# EAGLE design powerPanel (EAGLE 4.16)
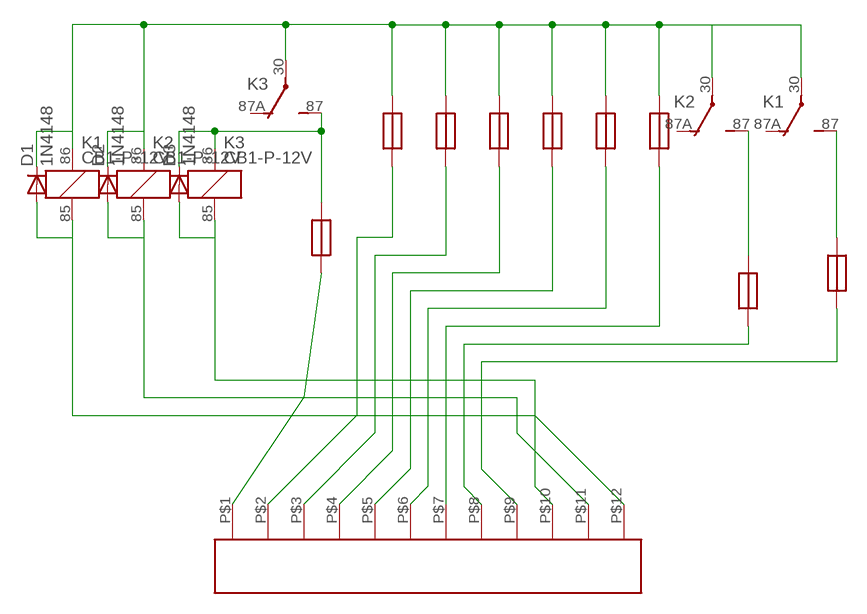
[diagram p0: schematic, sheet 1]

## Parts
D1  1N4148  [DO35-10]
D2  1N4148  [DO35-10]
D3  1N4148  [DO35-10]
K1  CB1-P-12V  [CB1]
K2  CB1-P-12V  [CB1]
K3  CB1-P-12V  [CB1]
U$1  STRIP12  [STRIP12]
U$2  FUSE  [FUSE]
U$3  FUSE  [FUSE]
U$4  FUSE  [FUSE]
U$5  FUSE  [FUSE]
U$6  FUSE  [FUSE]
U$7  FUSE  [FUSE]
U$8  FUSE  [FUSE]
U$9  FUSE  [FUSE]
U$10  FUSE  [FUSE]

## Nets
N$1: U$1.P$1 U$10.P$1
N$2: K2.87(2:S) U$8.P$4
N$3: D1.C D2.C K1.30(2:P) K1.86 K2.30(2:P) K2.86 K3.30(2:P) U$2.P$4 U$3.P$4 U$4.P$4 U$5.P$4 U$6.P$4 U$7.P$4
N$4: K1.87(2:S) U$9.P$4
N$5: U$1.P$7 U$7.P$1
N$6: U$1.P$2 U$2.P$1
N$7: U$1.P$3 U$3.P$1
N$8: U$1.P$4 U$4.P$1
N$10: U$1.P$5 U$5.P$1
N$11: U$1.P$6 U$6.P$1
N$12: U$1.P$8 U$8.P$1
N$13: U$1.P$9 U$9.P$1
N$14: D3.A K3.85 U$1.P$10
N$15: D2.A K2.85 U$1.P$11
N$16: D1.A K1.85 U$1.P$12
N$17: D3.C K3.86 K3.87(2:S) U$10.P$4
Unconnected: K1.87A(2:O) K2.87A(2:O) K3.87A(2:O)

## Library data of the parts
D1-D3 = diode:1N4148: DIODE high speed (Philips)
K1-K3 = relay:CB1*: HIGH POWER AUTOMOTIVE RELAY Form C NAiS Source: http://www.mew-europe.com/.. en_ds_61202_0000.pdf
U$1 = rnie04:STRIP12
U$2-U$10 = rnie04:FUSE

## Board
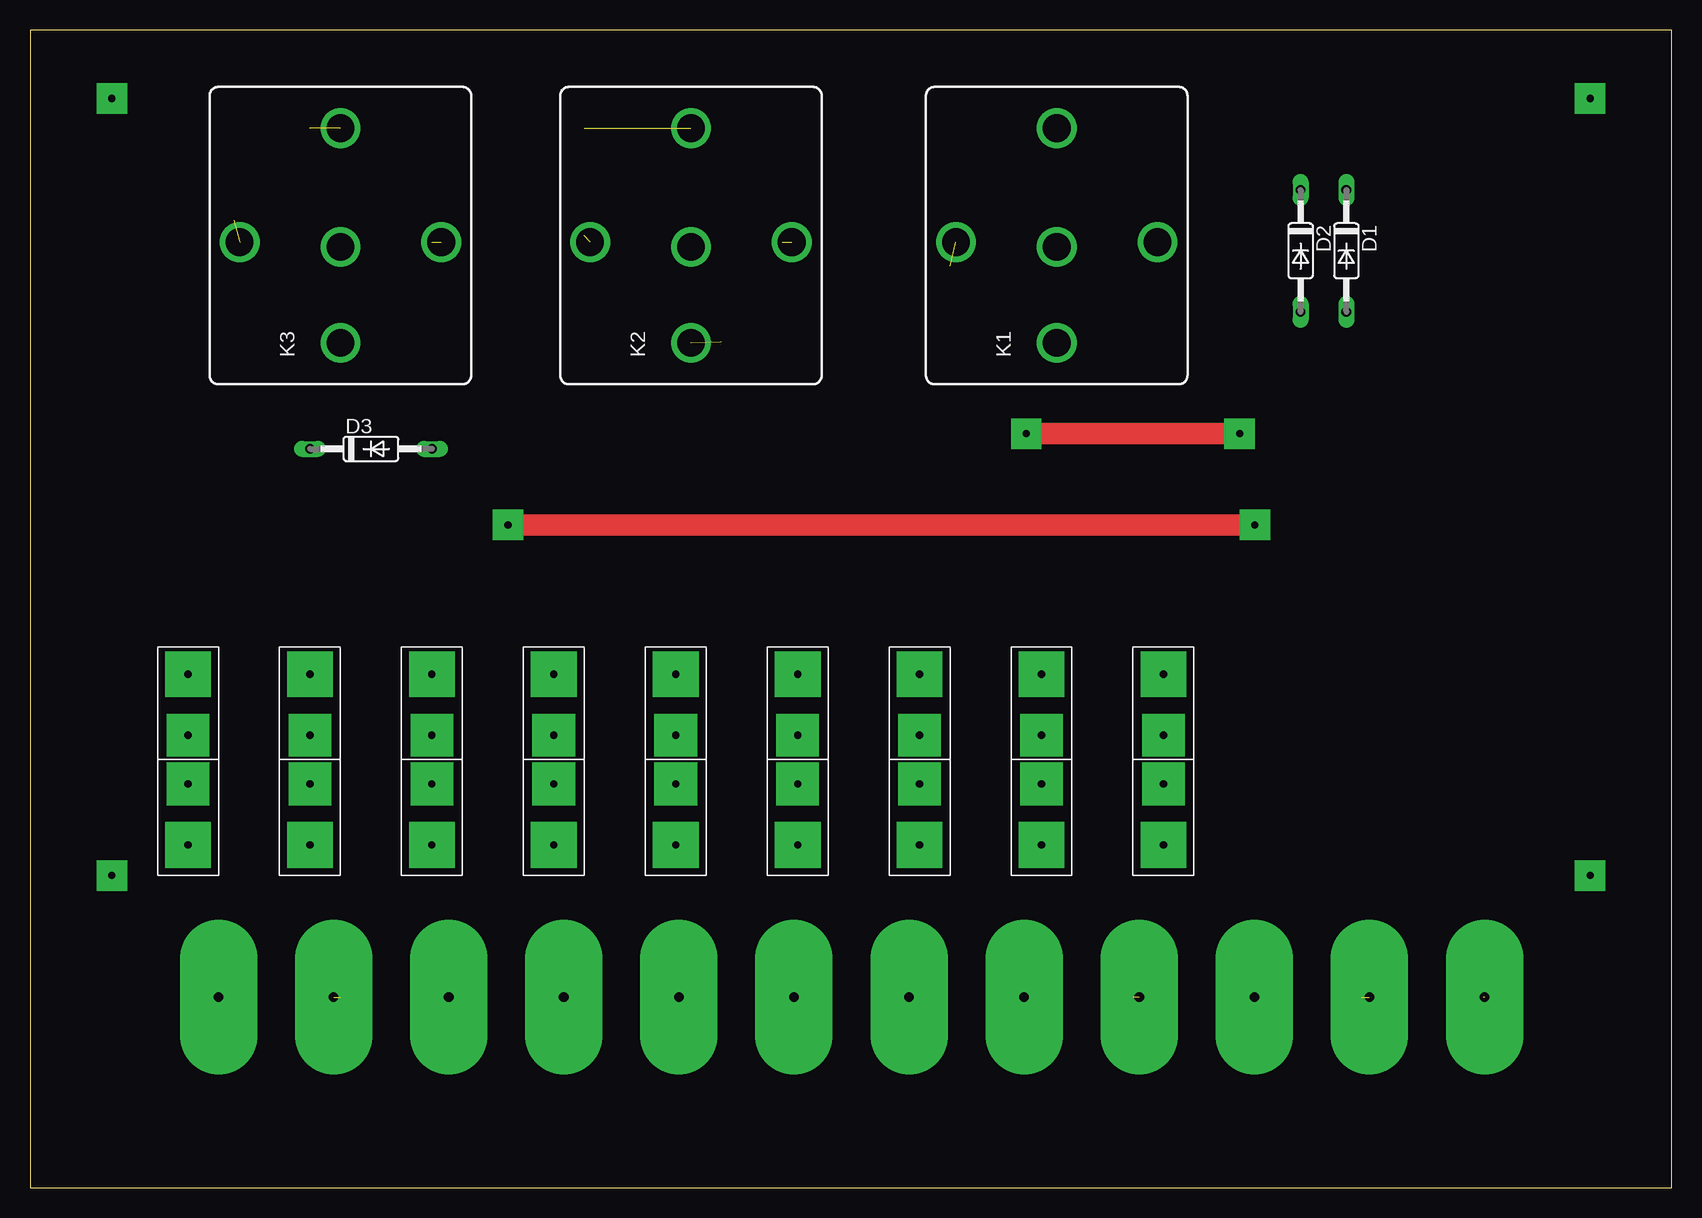
[diagram p1: board, top side]
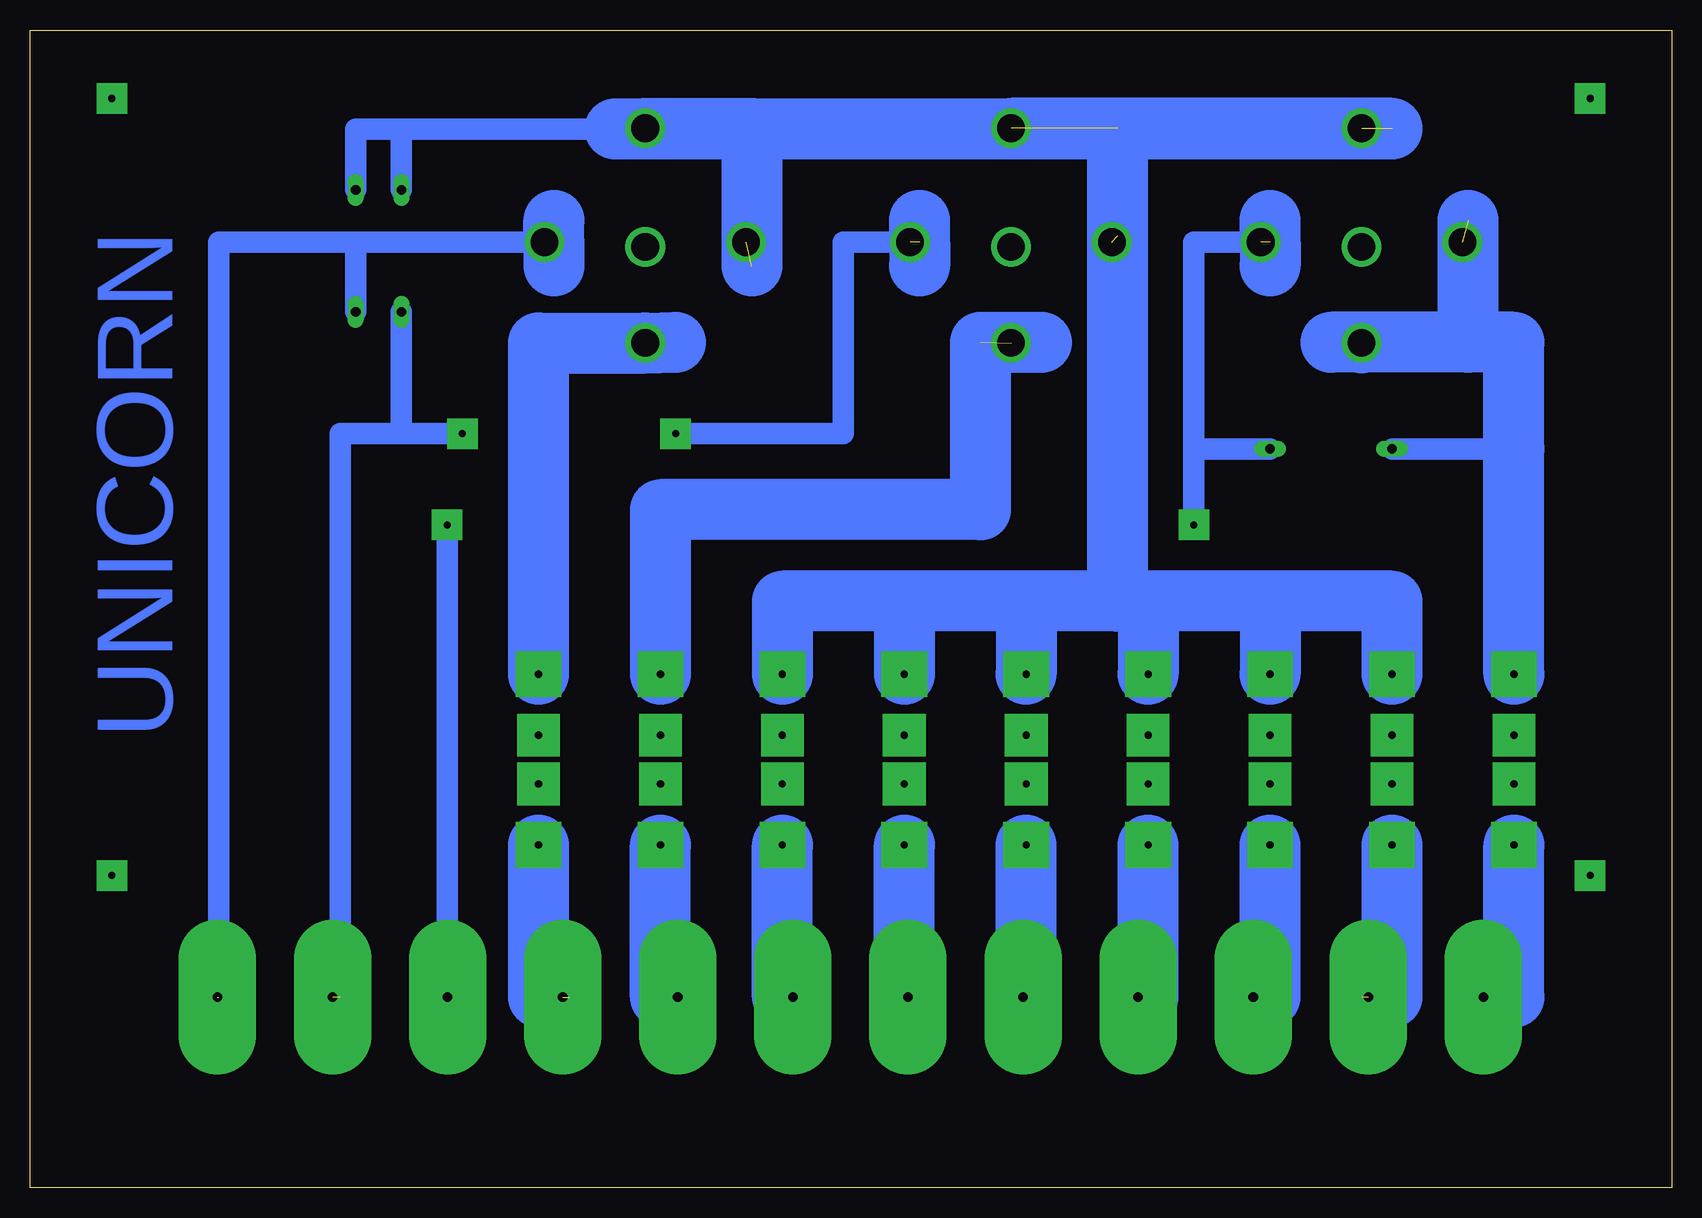
[diagram p2: board, bottom side, seen from below]

Size 136.83 x 96.51 mm. Coordinates in mm from the lower left corner, seen from the top.
Outline: 0,0 136.83,0 136.83,96.51 0,96.51 0,0
Copper layers (1*16): Top 0.035mm / dielectric 1.5mm / Bottom 0.035mm
Design rules "default": minimum track width 10mil, minimum drill 24mil, track to track 8mil, track to pad 8mil, pad to pad 8mil, via to via 8mil, smd to smd 8mil, copper to edge 40mil, drill to drill 8mil, minimum pad ring 10mil, minimum via ring 8mil, stop-mask expansion 4mil, vias tented up to drill 0mil, thermal gap 10mil

### Footprints (pad centres in the part's own frame; a part is rotated, then mirrored left to right if it is on the bottom)
DO35-10 = drill 0.813 long: A 5.08,0; C -5.08,0
CB1 = drill 2.3 round: 30 8.95,0; 85 -0.55,-8.4; 86 -0.55,8.4; 87 -8.95,0; 87A -0.95,0
STRIP12 = drill 0.8 pad 6.452 long: P$1 -45.72,-1.27; P$2 -36.129,-1.27; P$3 -26.538,-1.27; P$4 -16.947,-1.27; P$5 -7.356,-1.27; P$6 2.235,-1.27; P$7 11.826,-1.27; P$8 21.417,-1.27; P$9 31.008,-1.27; P$10 40.599,-1.27; P$11 50.188,-1.27; P$12 59.779,-1.27
FUSE = drill 0.6 pad 3.81 square: P$1 0,0; P$4 0,14.224 | drill 0.6 pad 3.556 square: P$2 0,5.08; P$3 0,9.144

### Placement (x,y rotation side)
D1  109.69,78.1 270 top
D2  105.88,78.1 270 top
D3  28.41,61.59 0 top
K1  85.56,79.37 90 top
K2  55.08,79.37 90 top
K3  25.87,79.37 90 top
U$1  61.43,17.14 0 top
U$2  23.33,28.57 0 top
U$3  33.49,28.57 0 top
U$4  43.65,28.57 0 top
U$5  53.81,28.57 0 top
U$6  63.97,28.57 0 top
U$7  74.13,28.57 0 top
U$8  84.29,28.57 0 top
U$9  94.45,28.57 0 top
U$10  13.17,28.57 0 top

### Tracks (layer width: path | path; a pad name or v marks a point on that pad's centre or on a via)
N$1
  Bottom 5.08: U$10.P$1 13.17,15.87 U$1.P$1
N$2  (1 unrouted)
  Bottom 5.08: U$8.P$4 84.29,56.51 57.62,56.51 57.62,70.48 52.54,70.48
N$3  (4 unrouted)
  Bottom 1.778: D1.C 109.69,88.26 105.88,88.26 | K1.30 85.56,88.26 105.88,88.26 | 105.88,88.26 D2.C
  Bottom 5.08: 46.19,88.32 46.19,79.37 46.19,48.89 | U$2.P$4 23.33,48.89 33.49,48.89 | 33.49,48.89 43.65,48.89 | 46.19,48.89 53.81,48.89 | 53.81,48.89 63.97,48.89 | 63.97,48.89 74.13,48.89 U$7.P$4 | 33.49,48.89 U$3.P$4 | 43.65,48.89 U$4.P$4 | 53.81,48.89 U$5.P$4 | 63.97,48.89 U$6.P$4 | 43.65,48.89 46.19,48.89 | K2.30 23.33,88.32 23.33,88.26 85.56,88.26 88.1,88.26 | K1.30 76.67,88.32 76.67,76.83
N$4
  Bottom 5.08: U$9.P$4 94.45,70.42 K1.87 83.02,70.48
N$5
  Bottom 5.08: 72.86,15.87 U$1.P$7 74.13,15.87 U$7.P$1
N$6  (1 unrouted)
  Bottom 5.08: U$2.P$1 23.33,15.87 25.87,15.87
N$7
  Bottom 5.08: U$3.P$1 33.49,15.87 U$1.P$3
N$8
  Bottom 5.08: 44.92,15.87 U$1.P$4 43.65,15.87 U$4.P$1
N$9  (via drill 0.6 pad 2.54)
  other vias: 6.82,90.8
N$10
  Bottom 5.08: U$1.P$5 53.81,15.87 U$5.P$1
N$11
  Bottom 5.08: U$1.P$6 63.97,15.87 U$6.P$1
N$12
  Bottom 5.08: U$8.P$1 84.29,15.87 U$1.P$8
N$13  (1 unrouted)
  Bottom 5.08: U$9.P$1 94.45,15.87 91.91,15.87
N$14  (via drill 0.6 pad 2.54)  (1 unrouted)
  Top 1.778: v39.84,55.24 v102.07,55.24
  Bottom 1.778: 39.84,61.59 v39.84,55.24 | 39.84,61.59 39.84,78.82 33.49,78.82 | U$1.P$10 102.07,17.14 v102.07,55.24 | D3.A 39.84,61.59
  Bottom 5.08: 33.49,80.64 33.49,78.82 33.49,76.83
N$15  (via drill 0.6 pad 2.54)  (2 unrouted)
  Top 1.778: v83.02,62.86 v100.8,62.86
  Bottom 1.778: v83.02,62.86 69.05,62.86 69.05,78.82 62.7,78.82 | v100.8,62.86 105.88,62.86 | 105.88,62.86 110.96,62.86 110.96,15.87 | 105.88,62.86 D2.A
  Bottom 5.08: 62.7,80.64 62.7,78.82 62.7,76.83
N$16  (1 unrouted)
  Bottom 1.778: 121.12,15.87 121.12,17.14 121.12,78.82 K1.85 | K1.85 93.18,78.82 | K1.85 109.69,78.82 D1.A
  Bottom 5.08: 93.18,80.64 93.18,78.82 93.18,76.83
N$17  (1 unrouted)
  Bottom 1.778: 13.17,61.59 D3.C
  Bottom 5.08: U$10.P$4 13.17,61.59 13.17,70.48 16.98,70.48 | 16.98,70.48 16.98,80.64 | 16.98,70.48 25.87,70.48 | 25.87,70.48 28.41,70.48 | 25.87,70.48 K3.87
N$18  (via drill 0.6 pad 2.54)
  other vias: 130.01,90.8
N$19  (via drill 0.6 pad 2.54)
  other vias: 130.01,26.03
N$20  (via drill 0.6 pad 2.54)
  other vias: 6.82,26.03

### Text on the board
Bottom: UNICORN